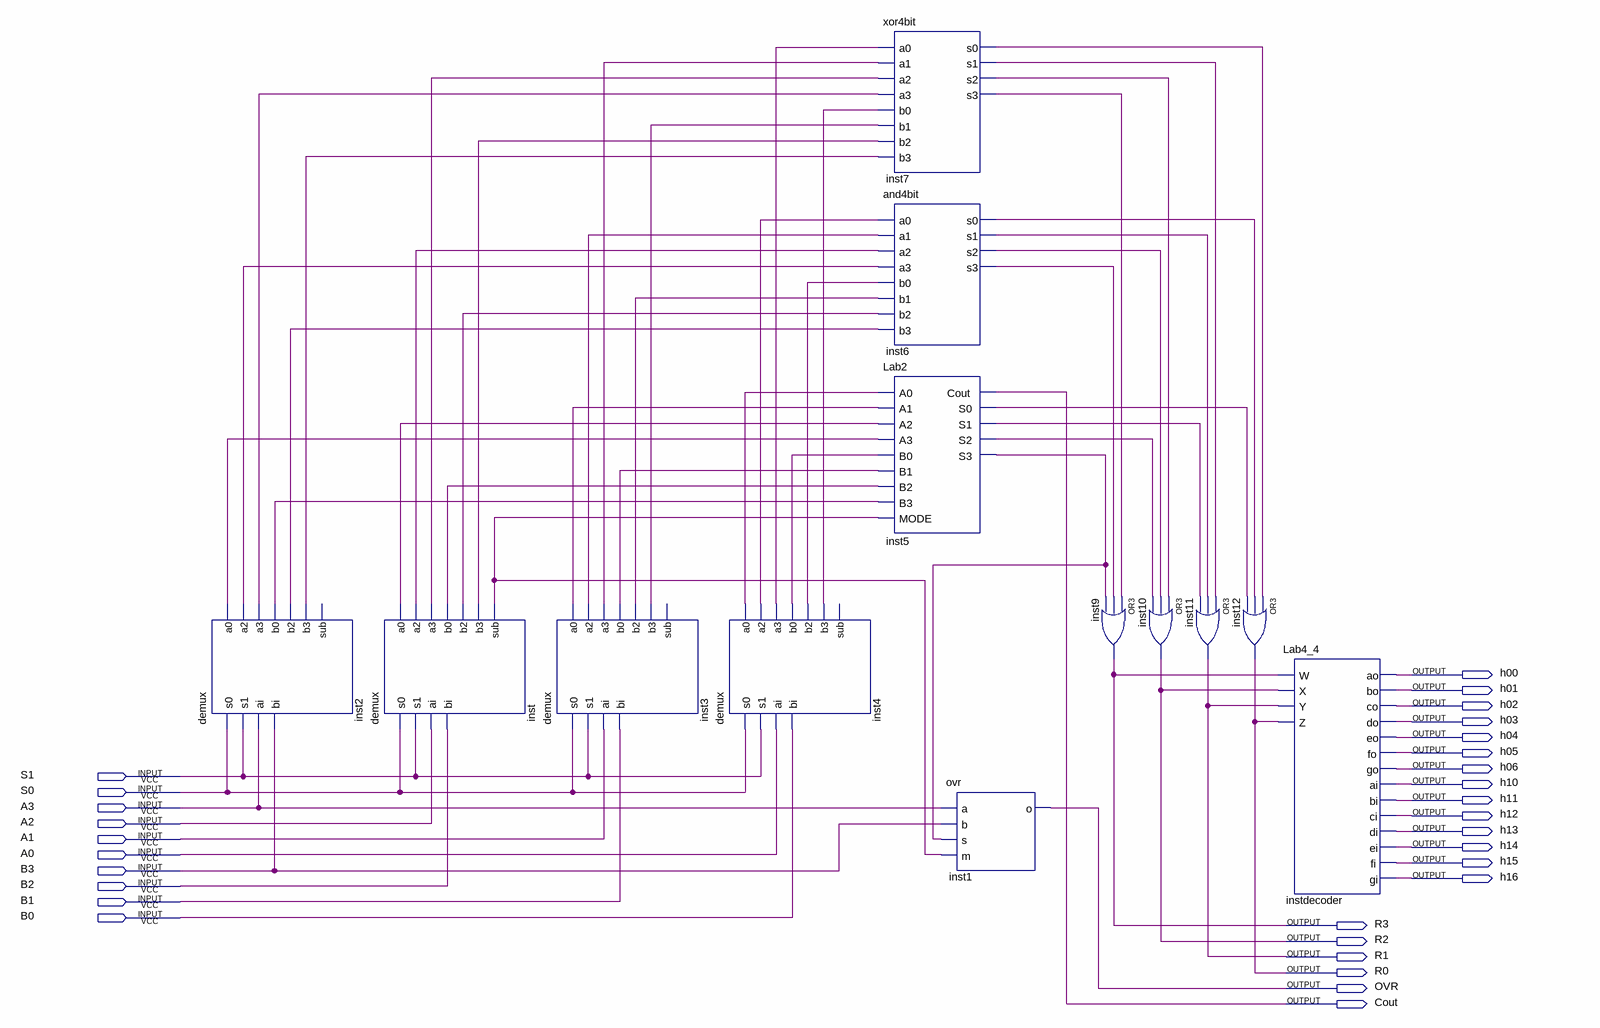
[diagram p0: schematic sheet]
// Quartus schematic Lab5.bdf as structural Verilog: 13 symbols, 30 pins
module Lab5 (
  input  S1,
  input  S0,
  input  A3,
  input  A2,
  input  A1,
  input  A0,
  input  B3,
  input  B2,
  input  B1,
  input  B0,
  output h00,
  output h01,
  output h02,
  output h03,
  output h04,
  output h05,
  output h06,
  output h10,
  output h11,
  output h12,
  output h13,
  output h14,
  output h15,
  output h16,
  output R3,
  output R2,
  output R1,
  output R0,
  output OVR,
  output Cout
);

  wire inst2_a0, inst2_a2, inst2_a3, inst2_b0, inst2_b2, inst2_b3, inst3_a0, inst3_a2, inst3_a3, inst3_b0,
       inst3_b2, inst3_b3, inst4_a0, inst4_a2, inst4_a3, inst4_b0, inst4_b2, inst4_b3, inst5_s0, inst5_s1,
       inst5_s2, inst5_s3, inst6_s0, inst6_s1, inst6_s2, inst6_s3, inst7_s0, inst7_s1, inst7_s2, inst7_s3,
       inst_a0, inst_a2, inst_a3, inst_b0, inst_b2, inst_b3, inst_sub;

  demux inst2 (
    .s0(S0), .s1(S1), .ai(A3), .bi(B3), .a0(inst2_a0), .a2(inst2_a2), .a3(inst2_a3), .b0(inst2_b0),
    .b2(inst2_b2), .b3(inst2_b3));  // open: sub
  demux inst (
    .s0(S0), .s1(S1), .ai(A2), .bi(B2), .a0(inst_a0), .a2(inst_a2), .a3(inst_a3), .b0(inst_b0), .b2(inst_b2),
    .b3(inst_b3), .sub(inst_sub));
  demux inst3 (
    .s0(S0), .s1(S1), .ai(A1), .bi(B1), .a0(inst3_a0), .a2(inst3_a2), .a3(inst3_a3), .b0(inst3_b0),
    .b2(inst3_b2), .b3(inst3_b3));  // open: sub
  demux inst4 (
    .s0(S0), .s1(S1), .ai(A0), .bi(B0), .a0(inst4_a0), .a2(inst4_a2), .a3(inst4_a3), .b0(inst4_b0),
    .b2(inst4_b2), .b3(inst4_b3));  // open: sub
  xor4bit inst7 (
    .a0(inst4_a3), .a1(inst3_a3), .a2(inst_a3), .a3(inst2_a3), .b0(inst4_b3), .b1(inst3_b3), .b2(inst_b3),
    .b3(inst2_b3), .s0(inst7_s0), .s1(inst7_s1), .s2(inst7_s2), .s3(inst7_s3));
  and4bit inst6 (
    .a0(inst4_a2), .a1(inst3_a2), .a2(inst_a2), .a3(inst2_a2), .b0(inst4_b2), .b1(inst3_b2), .b2(inst_b2),
    .b3(inst2_b2), .s0(inst6_s0), .s1(inst6_s1), .s2(inst6_s2), .s3(inst6_s3));
  Lab2 inst5 (
    .A0(inst4_a0), .A1(inst3_a0), .A2(inst_a0), .A3(inst2_a0), .B0(inst4_b0), .B1(inst3_b0), .B2(inst_b0),
    .B3(inst2_b0), .MODE(inst_sub), .Cout(Cout), .S0(inst5_s0), .S1(inst5_s1), .S2(inst5_s2), .S3(inst5_s3));
  ovr inst1 (.a(A3), .b(B3), .s(inst5_s3), .m(inst_sub), .o(OVR));
  or inst9 (R3, inst7_s3, inst6_s3, inst5_s3);
  or inst10 (R2, inst7_s2, inst6_s2, inst5_s2);
  or inst11 (R1, inst7_s1, inst6_s1, inst5_s1);
  or inst12 (R0, inst7_s0, inst6_s0, inst5_s0);
  Lab4_4 instdecoder (
    .W(R3), .X(R2), .Y(R1), .Z(R0), .ao(h00), .bo(h01), .co(h02), .\do (h03), .eo(h04), .fo(h05), .go(h06),
    .ai(h10), .bi(h11), .ci(h12), .di(h13), .ei(h14), .fi(h15), .gi(h16));
endmodule
